# EAGLE design ETESTER-3 (EAGLE 9.6.2)
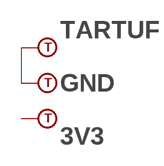
[diagram p0: schematic, sheet 1]

## Parts
3V3  TESPOINT-SMD1.5MM  [TESTPOINT-1.5MM]
GND  TESPOINT-SMD1.5MM  [TESTPOINT-1.5MM]
TARTUF  TESPOINT-SMD1.5MM  [TESTPOINT-1.5MM]

## Nets
GND: GND.1 TARTUF.1
Unconnected: 3V3.1

## Library data of the parts
3V3 GND TARTUF = Generics_stg:TESPOINT

## Board
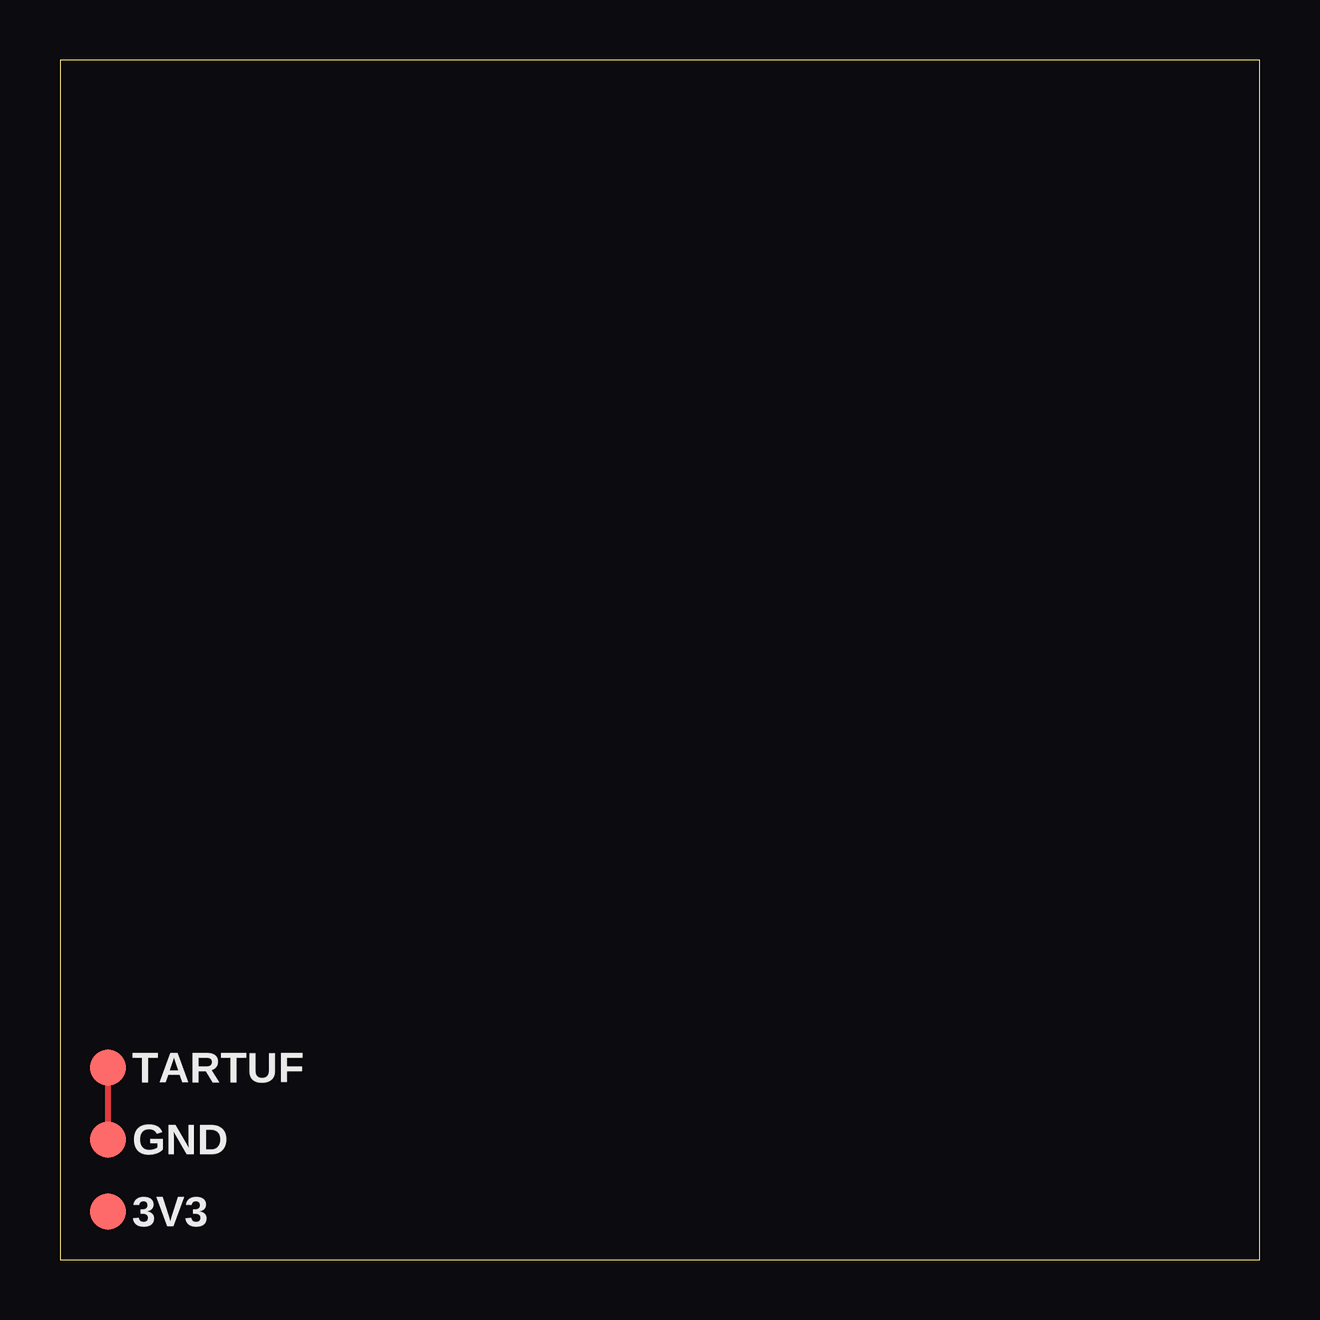
[diagram p1: board, top side]

Size 50 x 50 mm. Coordinates in mm from the lower left corner, seen from the top.
Outline: 0,0 50,0 50,50 0,50 0,0
Copper layers (1*16): Top 0.035mm / dielectric 1.5mm / Bottom 0.035mm
Design rules "default": minimum track width 10mil, minimum drill 24mil, track to track 8mil, track to pad 8mil, pad to pad 8mil, via to via 8mil, smd to smd 8mil, copper to edge 40mil, drill to drill 8mil, minimum pad ring 10mil, minimum via ring 8mil, stop-mask expansion 4mil, vias tented up to drill 0mil, thermal gap 10mil

### Footprints (pad centres in the part's own frame; a part is rotated, then mirrored left to right if it is on the bottom)
TESTPOINT-1.5MM = smd 1.5 x 1.5: 1 0,0

### Placement (x,y rotation side)
3V3  2,2 0 top
GND  2,5 0 top
TARTUF  2,8 0 top

### Tracks (layer width: path | path; a pad name or v marks a point on that pad's centre or on a via)
GND
  Top 0.254: GND.1 TARTUF.1